# EAGLE design 2021 Deployment REVB (EAGLE 9.6.2)

## Sheet 1 of 2: Template
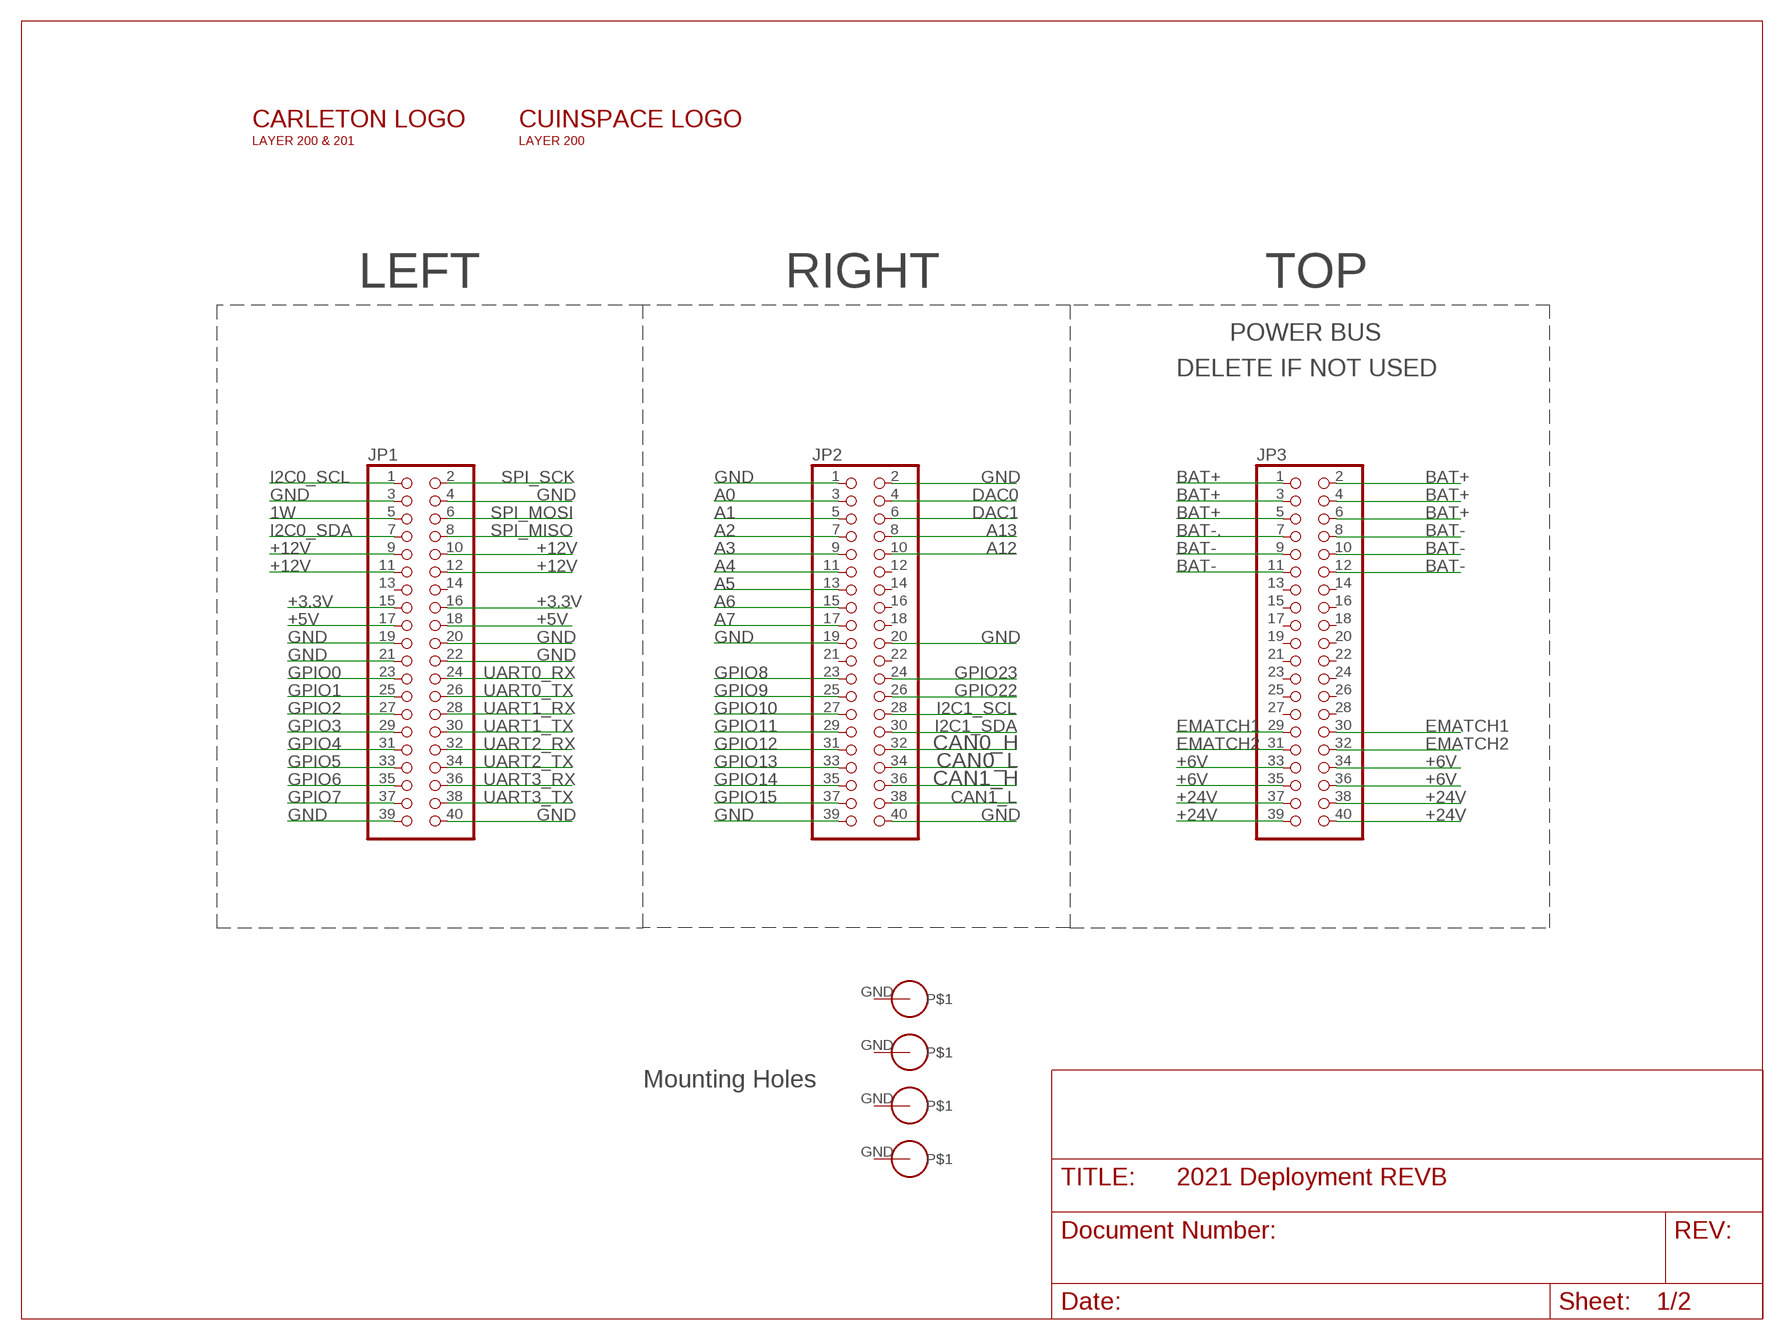
[diagram p0: schematic, sheet 1]

### Parts
$$U$1  PS/104-MOUNTING-HOLE  [PC/104-MOUNTING-HOLE]
JP1  PINHD-2X20  [2X20]
JP2  PINHD-2X20  [2X20]
JP3  PINHD-2X20  [2X20]
U$1  PS/104-MOUNTING-HOLE  [PC/104-MOUNTING-HOLE]
U$2  PS/104-MOUNTING-HOLE  [PC/104-MOUNTING-HOLE]
U$3  PS/104-MOUNTING-HOLE  [PC/104-MOUNTING-HOLE]
U$4  CARLETON3CM  [CARLETONU_3CM]
U$6  INSPACE3CM_L  [INSPACE_3CM_LETTERS]

### Nets
1W: JP1.5
+3.3V: JP1.15 JP1.16
+5V: JP1.17 JP1.18
+6V: JP3.33 JP3.34 JP3.35 JP3.36
+12V: JP1.9 JP1.10 JP1.11 JP1.12 ; also sheet 2
+24V: JP3.37 JP3.38 JP3.39 JP3.40
A0: JP2.3
A1: JP2.5
A2: JP2.7
A3: JP2.9
A4: JP2.11
A5: JP2.13
A6: JP2.15
A7: JP2.17
A12: JP2.10
A13: JP2.8
BAT+: JP3.1 JP3.2 JP3.3 JP3.4 JP3.5 JP3.6
BAT-: JP3.8 JP3.9 JP3.10 JP3.11 JP3.12
BAT-.: JP3.7
CAN0_H: JP2.32
CAN0_L: JP2.34
CAN1_H: JP2.36
CAN1_L: JP2.38
DAC0: JP2.4
DAC1: JP2.6
EMATCH1: JP3.29 JP3.30 ; also sheet 2
EMATCH2: JP3.31 JP3.32 ; also sheet 2
GND [New Class]: JP1.3 JP1.4 JP1.19 JP1.20 JP1.21 JP1.22 JP1.39 JP1.40 JP2.1 JP2.2 JP2.19 JP2.20 JP2.39 JP2.40 ; also sheet 2
GPIO0: JP1.23
GPIO1: JP1.25
GPIO2: JP1.27
GPIO3: JP1.29
GPIO4: JP1.31
GPIO5: JP1.33
GPIO6: JP1.35
GPIO7: JP1.37
GPIO8: JP2.23
GPIO9: JP2.25
GPIO10: JP2.27
GPIO11: JP2.29
GPIO12: JP2.31
GPIO13: JP2.33
GPIO14: JP2.35
GPIO15: JP2.37
GPIO22: JP2.26 ; also sheet 2
GPIO23: JP2.24 ; also sheet 2
I2C0_SCL: JP1.1
I2C0_SDA: JP1.7
I2C1_SCL: JP2.28
I2C1_SDA: JP2.30
SPI_MISO: JP1.8
SPI_MOSI: JP1.6
SPI_SCK: JP1.2
UART0_RX: JP1.24
UART0_TX: JP1.26
UART1_RX: JP1.28
UART1_TX: JP1.30
UART2_RX: JP1.32
UART2_TX: JP1.34
UART3_RX: JP1.36
UART3_TX: JP1.38
Unconnected: $$U$1.GND JP1.13 JP1.14 JP2.12 JP2.14 JP2.16 JP2.18 JP2.21 JP2.22 JP3.13 JP3.14 JP3.15 JP3.16 JP3.17 JP3.18 JP3.19 JP3.20 JP3.21 JP3.22 JP3.23 JP3.24 JP3.25 JP3.26 JP3.27 JP3.28 U$1.GND U$2.GND U$3.GND

### Notes on the sheet
- LEFT | RIGHT | TOP
- POWER BUS
- DELETE IF NOT USED
- Mounting Holes

## Sheet 2 of 2
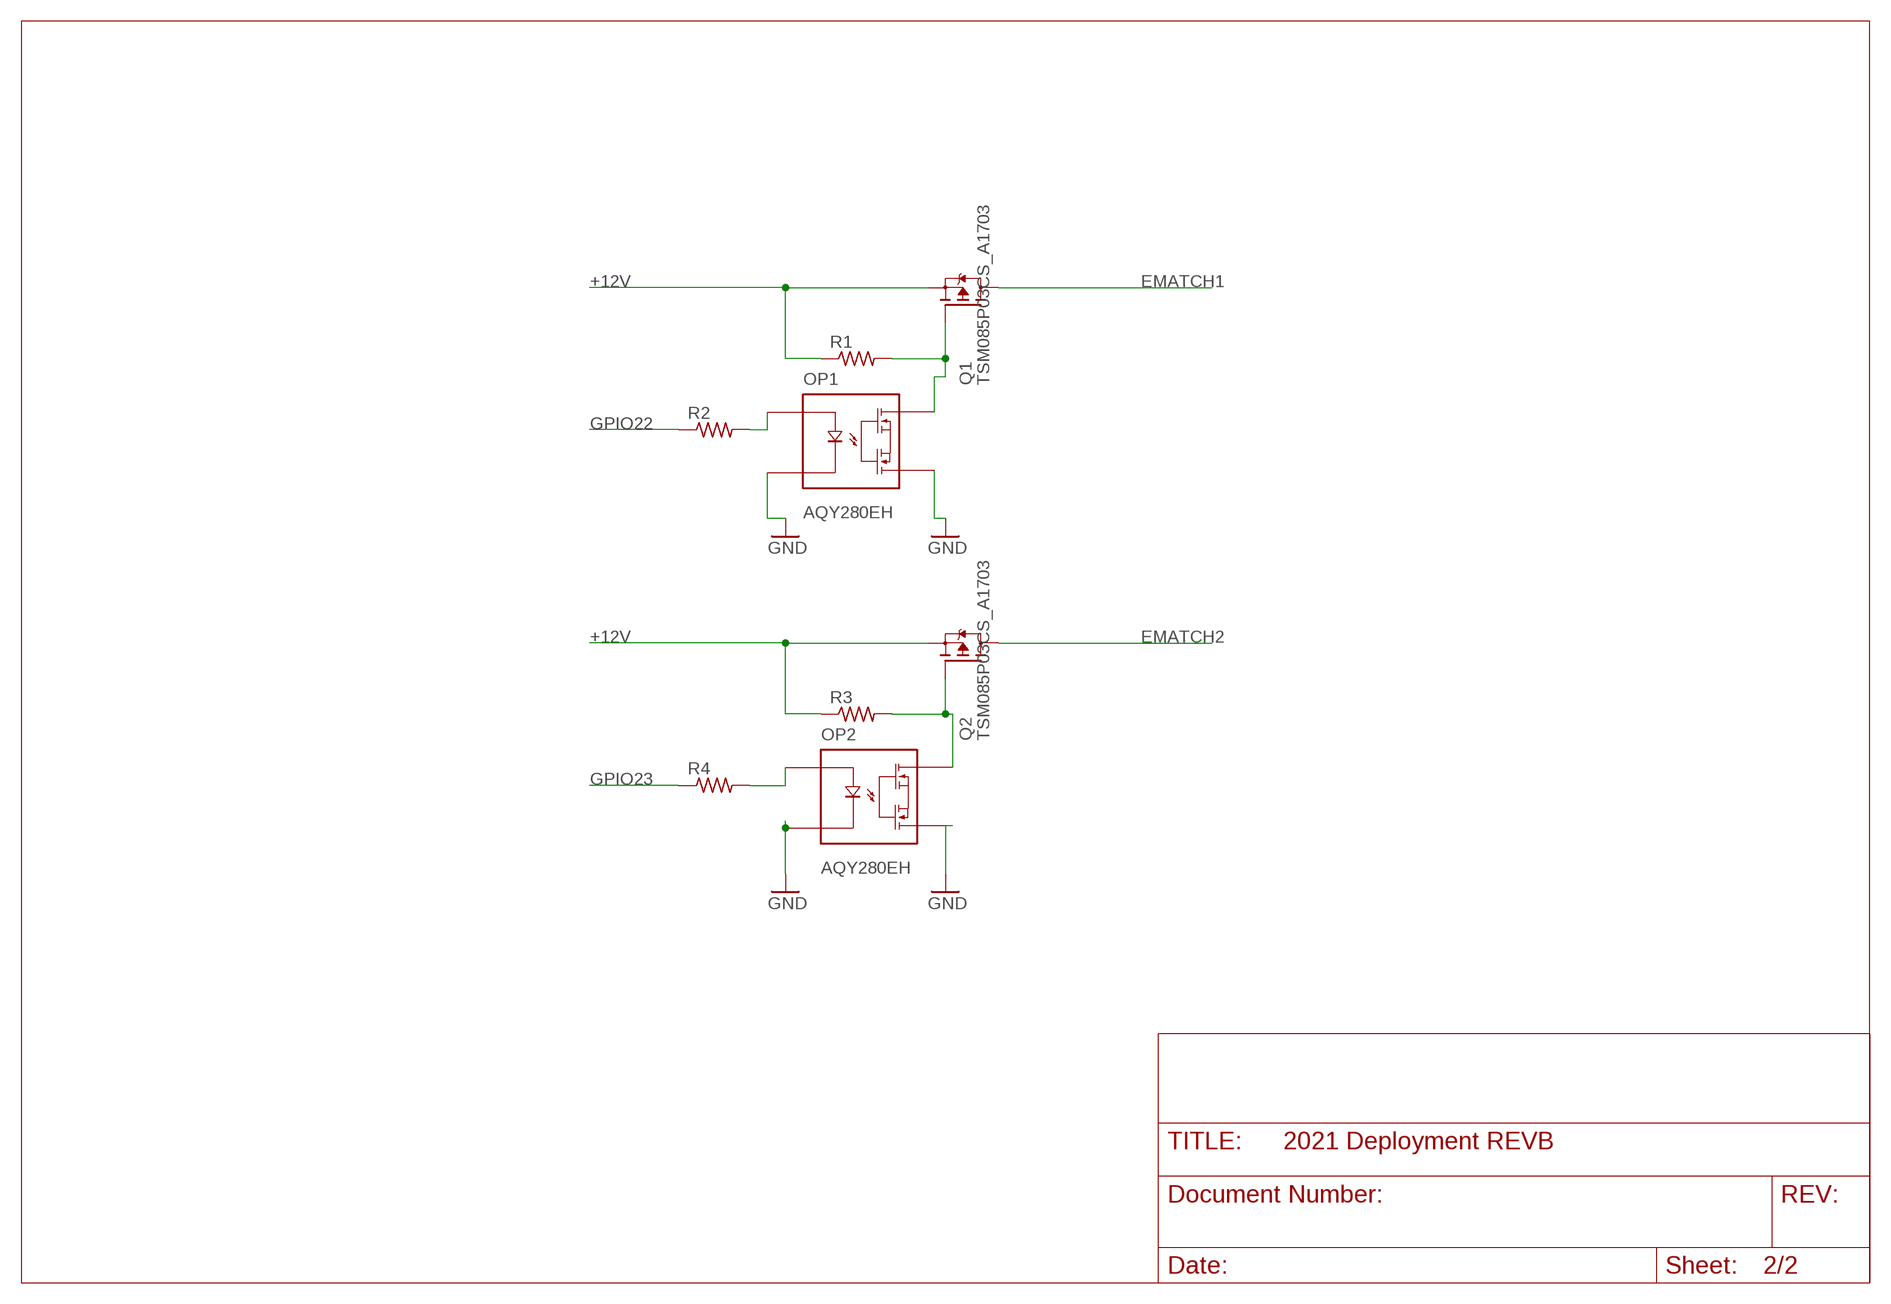
[diagram p1: schematic, sheet 2]

### Parts
OP1  AQY280EH  [AQY280EH]
OP2  AQY280EH  [AQY280EH]
Q1  TSM085P03CS_A1703  [TSM085P03CS_A1703]
Q2  TSM085P03CS_A1703  [TSM085P03CS_A1703]
R1  R-US_R0805  [R0805]
R2  R-US_R0805  [R0805]
R3  R-US_R0805  [R0805]
R4  R-US_R0805  [R0805]

### Nets
+12V: Q1.PIN1(S) Q1.PIN2(S) Q1.PIN3(S) Q2.PIN1(S) Q2.PIN2(S) Q2.PIN3(S) R1.1 R3.1 ; also sheet 1
EMATCH1: Q1.PIN5(D) Q1.PIN6(D) Q1.PIN7(D) Q1.PIN8(D) ; also sheet 1
EMATCH2: Q2.PIN5(D) Q2.PIN6(D) Q2.PIN7(D) Q2.PIN8(D) ; also sheet 1
GND [New Class]: OP1.PIN2(C) OP1.PIN3(BOTTOM) OP2.PIN2(C) OP2.PIN3(BOTTOM) ; also sheet 1
GPIO22: R2.1 ; also sheet 1
GPIO23: R4.1 ; also sheet 1
N$1: OP2.PIN1(A) R4.2
N$2: OP2.PIN4(TOP) Q2.PIN4(G) R3.2
N$3: OP1.PIN1(A) R2.2
N$5: OP1.PIN4(TOP) Q1.PIN4(G) R1.2

## Library data of the parts
$$U$1 U$1-U$3 = CU inSpace 2019 Parts:PS/104-MOUNTING-HOLE: Mounting hole for PC/104 board.
JP1-JP3 = pinhead:PINHD-2X20: PIN HEADER
OP1 OP2 = Deployment REVB:AQY280EH
Q1 Q2 = Deployment REVB:TSM085P03CS_A1703
R1-R4 = rcl:R-US_: RESISTOR, American symbol; SPICEPREFIX: R
U$4 = Logos:CARLETON
U$6 = Logos:INSPACE

## Net classes
2 diff pairs: width 0.254 mm

## Board
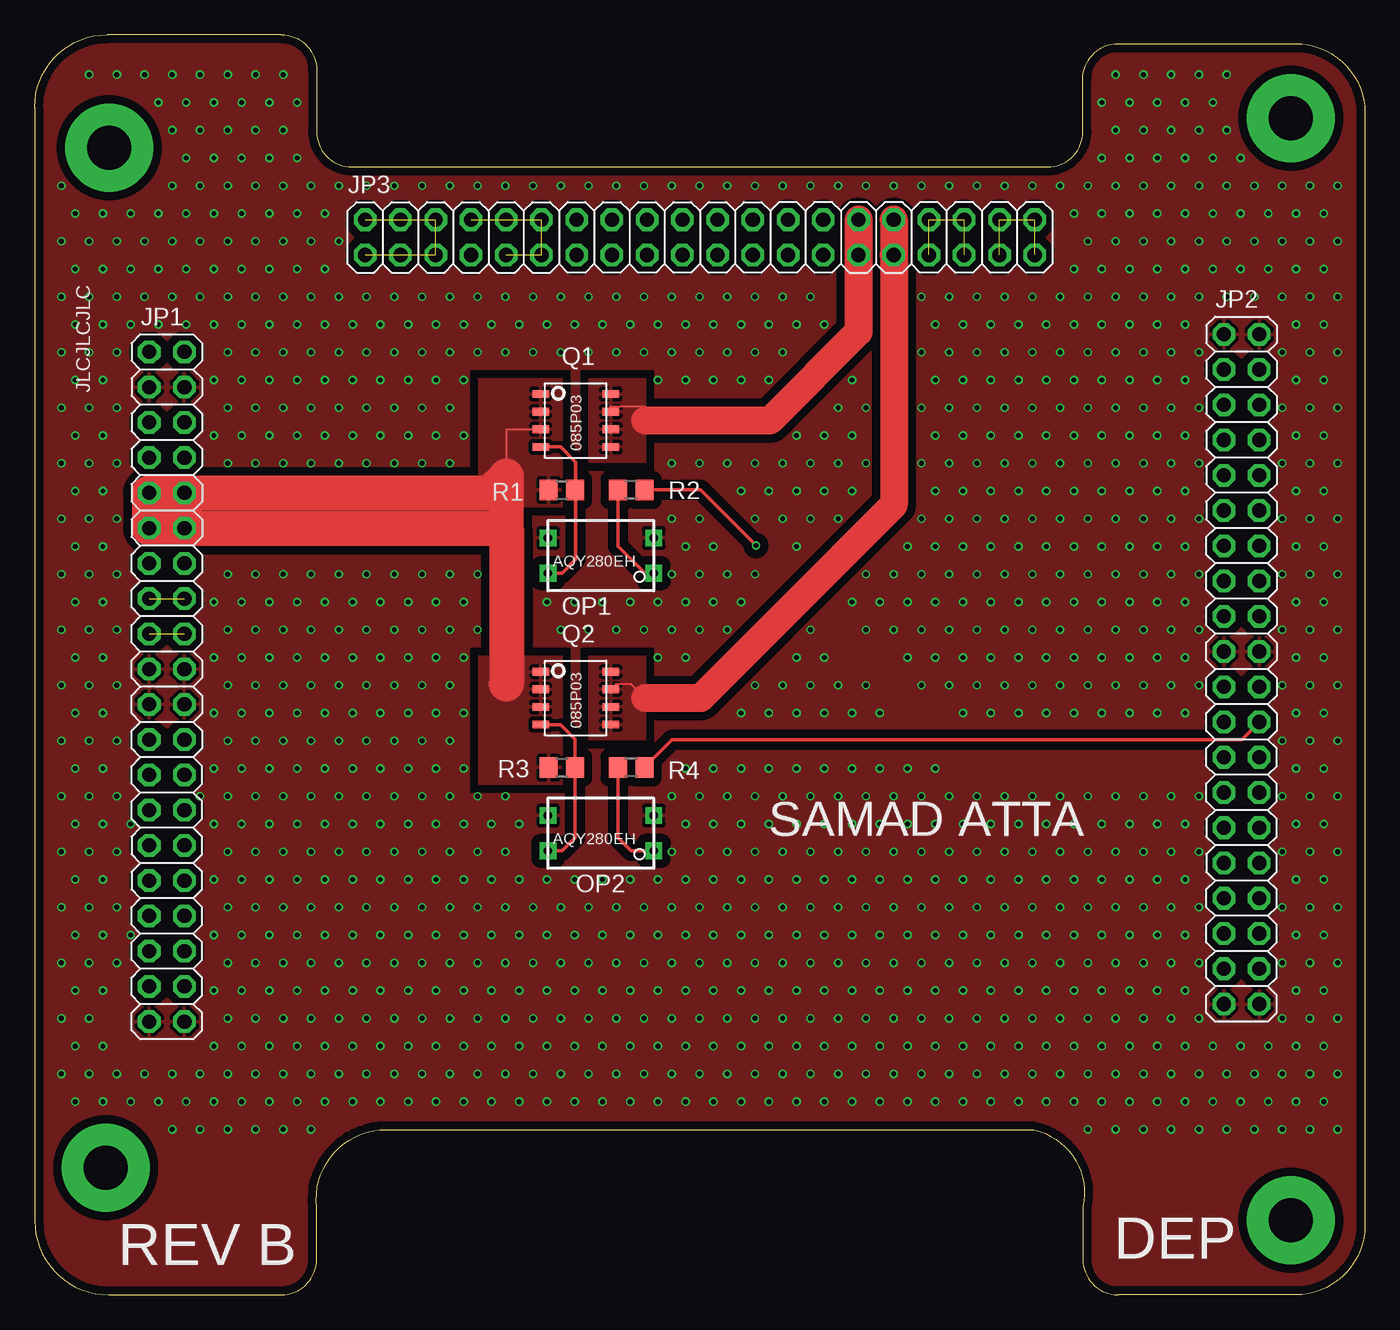
[diagram p2: board, top side]
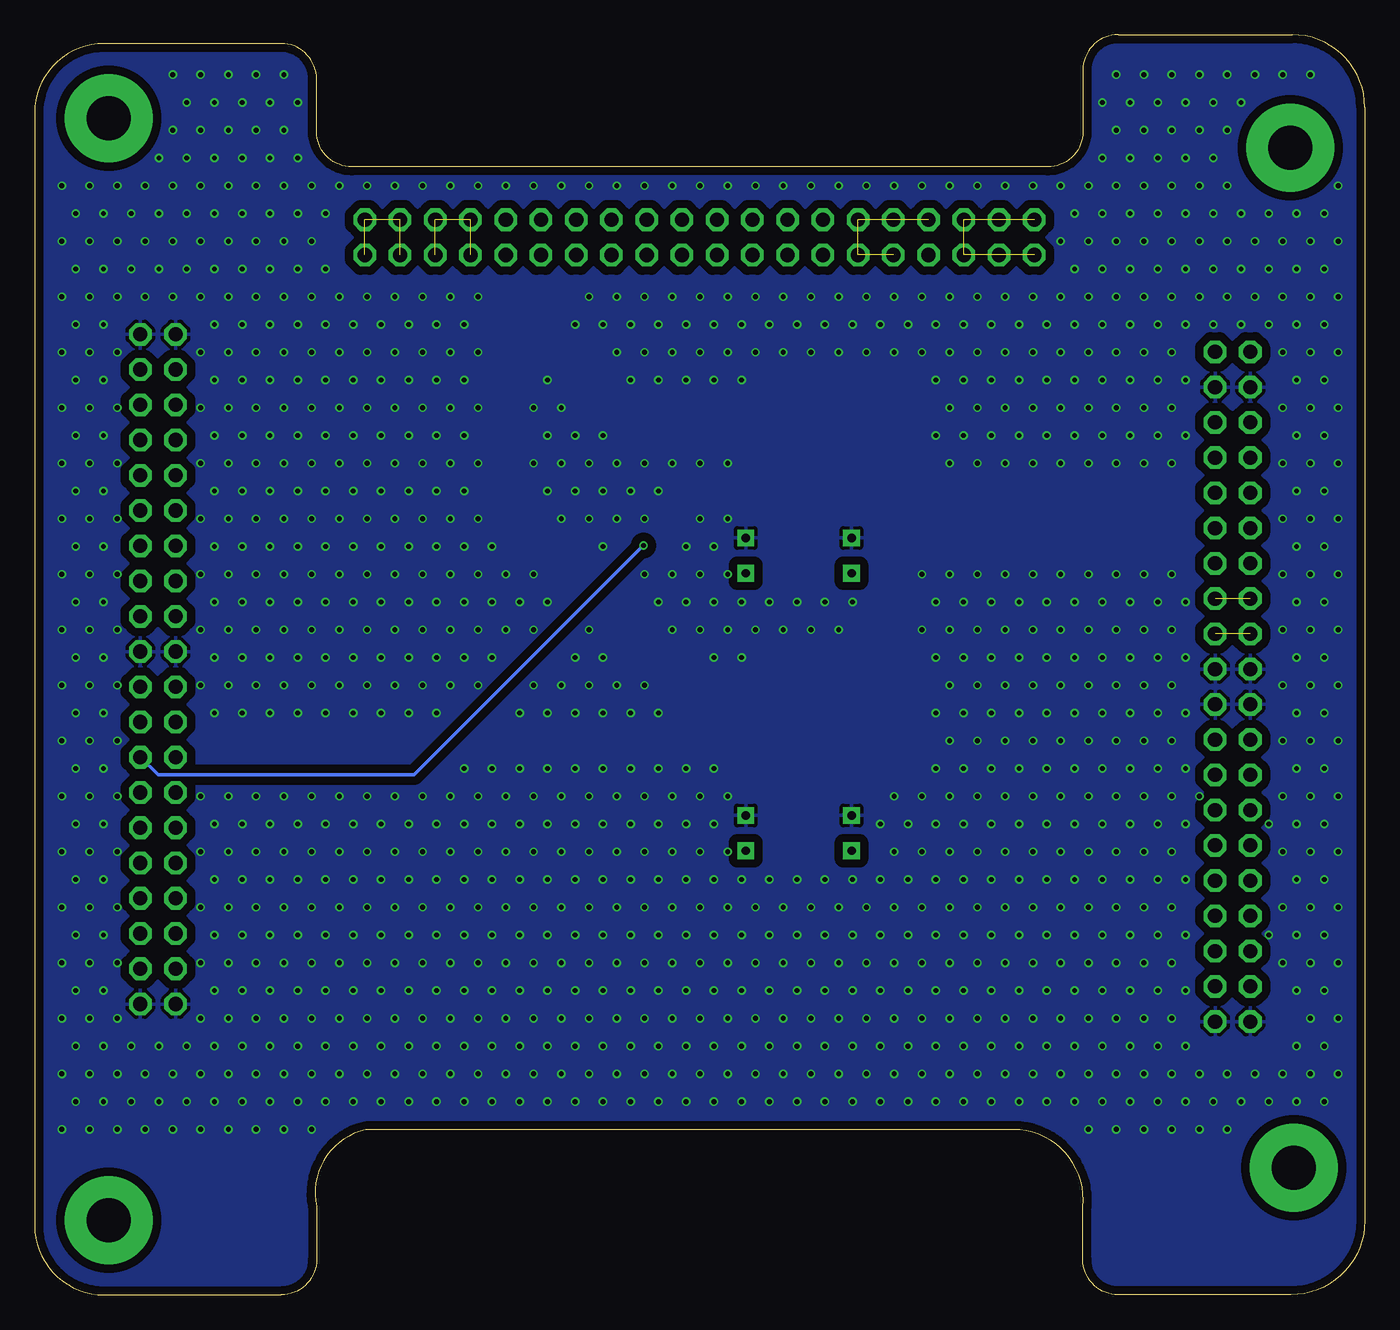
[diagram p3: board, bottom side, seen from below]

Size 95.89 x 90.81 mm. Coordinates in mm from the lower left corner, seen from the top.
Outline: 0,85.57 0,5.33 arc90 5.33,0 17.78,0 arc90 20.32,2.54 20.32,6.35 arc-90 24.86,11.89 72.03,11.89 arc-90 75.56,6.35 75.56,2.54 arc90 78.11,0 90.89,0 arc90 95.89,5 95.89,85.17 arc90 90.89,90.17 78.11,90.17 arc90 75.56,87.63 75.56,83.82 arc-90 73.03,81.28 22.86,81.28 arc-90 20.32,83.82 20.32,88.27 arc90 17.78,90.81 5.23,90.81 arc90 0,85.57
Copper layers (1*16): Top 0.035mm / dielectric 1.53mm / Bottom 0.035mm
Design rules "JLC 2 Layer *": minimum track width 5mil, minimum drill 0.2mm, track to track 3.5mil, track to pad 3.5mil, pad to pad 5mil, via to via 10mil, smd to smd 0mil, copper to edge 10mil, drill to drill 10mil, minimum pad ring 12mil, minimum via ring 5mil, stop-mask expansion 4mil, vias tented up to drill 0.4mm, thermal gap 10mil

### Footprints (pad centres in the part's own frame; a part is rotated, then mirrored left to right if it is on the bottom)
PC/104-MOUNTING-HOLE = drill 3.175 pad 6.35: GND 0,0
2X20 = drill 1.016 octagon: 1 -24.13,-1.27; 2 -24.13,1.27; 3 -21.59,-1.27; 4 -21.59,1.27; 5 -19.05,-1.27; 6 -19.05,1.27; 7 -16.51,-1.27; 8 -16.51,1.27; 9 -13.97,-1.27; 10 -13.97,1.27; 11 -11.43,-1.27; 12 -11.43,1.27; 13 -8.89,-1.27; 14 -8.89,1.27; 15 -6.35,-1.27; 16 -6.35,1.27; 17 -3.81,-1.27; 18 -3.81,1.27; 19 -1.27,-1.27; 20 -1.27,1.27; 21 1.27,-1.27; 22 1.27,1.27; 23 3.81,-1.27; 24 3.81,1.27; 25 6.35,-1.27; 26 6.35,1.27; 27 8.89,-1.27; 28 8.89,1.27; 29 11.43,-1.27; 30 11.43,1.27; 31 13.97,-1.27; 32 13.97,1.27; 33 16.51,-1.27; 34 16.51,1.27; 35 19.05,-1.27; 36 19.05,1.27; 37 21.59,-1.27; 38 21.59,1.27; 39 24.13,-1.27; 40 24.13,1.27
AQY280EH = drill 0.6 pad 0.813 square: PIN1 0,-7.62; PIN2 2.54,-7.62; PIN3 2.54,0; PIN4 0,0
TSM085P03CS_A1703 = smd 0.559 x 1.194: PIN1 -1.905,-2.527; PIN2 -0.635,-2.527; PIN3 0.635,-2.527; PIN4 1.905,-2.527; PIN5 1.905,2.527; PIN6 0.635,2.527; PIN7 -0.635,2.527; PIN8 -1.905,2.527
R0805 = smd 1.3 x 1.5: 1 -0.95,0; 2 0.95,0

### Placement (x,y rotation side)
$$U$1  5.13,9.17 0 top
JP1  9.53,43.81 270 top
JP2  87,45.09 270 top
JP3  47.96,76.2 0 top
OP1  37,52 90 top
OP2  37,32 90 top
Q1  39,63 270 top
Q2  39,43 270 top
R1  38,58 0 top
R2  43,58 180 top
R3  38,38 0 top
R4  43,38 180 top
U$1  90.55,84.79 0 top
U$2  5.36,82.65 0 top
U$3  90.55,5.36 0 top
U$4  17.3,18.5 0 top
U$6  50.91,21.53 0 top

### Tracks (layer width: path | path; a pad name or v marks a point on that pad's centre or on a via)
+3.3V  (1 unrouted)
+5V  (1 unrouted)
+6V  (3 unrouted)
+12V
  Top 0.127: Q1.PIN3 34,62.37 34,59
  Top 2.54: JP1.9 JP1.12 | JP1.11 JP1.10 | JP1.10 JP1.12 | JP1.9 JP1.11 | JP1.9 JP1.10 | JP1.11 JP1.12 | JP1.10 32.78,57.78 34,59 34,55.24 | JP1.12 34,55.24 | 34,55.24 34,44
  pour Top (isolate 0.305): 32,66 32,56.8 38,56.8 38,66
  pour Top (isolate 0.305): 32,46 32,36.8 38,36.8 38,46
+24V  (3 unrouted)
BAT+  (5 unrouted)
BAT-  (4 unrouted)
EMATCH1
  Top 0.127: 44,63 44,64 41.53,64 Q1.PIN7
  Top 2: JP3.30 JP3.29 59.38,69.39 53,63 44,63
  pour Top: 40,60 40,66 44,66 44,60
EMATCH2
  Top 0.127: 44,43 43,44 41.89,44 Q2.PIN7
  Top 2: JP3.32 JP3.31 61.92,56.92 48,43 44,43
  pour Top: 40,40 40,46 44,46 44,40
GND  (via drill 0.35)
  other vias: 2.92,13.92 1.92,15.92 2.92,17.92 1.92,19.92 2.92,21.92 1.92,23.92 2.92,25.92 1.92,27.92 2.92,29.92 1.92,31.92 2.92,33.92 1.92,35.92 2.92,37.92 1.92,39.92 2.92,41.92 1.92,43.92 2.92,45.92 1.92,47.92 2.92,49.92 1.92,51.92 2.92,53.92 1.92,55.92 2.92,57.92 1.92,59.92 2.92,61.92 1.92,63.92 2.92,65.92 1.92,67.92 2.92,69.92 1.92,71.92 2.92,73.92 1.92,75.92 2.92,77.92 1.92,79.92 4.92,13.92 3.92,15.92 4.92,17.92 3.92,19.92 4.92,21.92 3.92,23.92 4.92,25.92 3.92,27.92 4.92,29.92 3.92,31.92 4.92,33.92 3.92,35.92 4.92,37.92 3.92,39.92 4.92,41.92 3.92,43.92 4.92,45.92 3.92,47.92 4.92,49.92 3.92,51.92 4.92,53.92 3.92,55.92 4.92,57.92 3.92,59.92 4.92,61.92 3.92,63.92 4.92,65.92 3.92,67.92 4.92,69.92 3.92,71.92 4.92,73.92 3.92,75.92 4.92,77.92 3.92,87.92 6.92,13.92 5.92,15.92 5.92,23.92 6.92,25.92 5.92,27.92 5.92,31.92 6.92,33.92 5.92,35.92 5.92,39.92 5.92,43.92 5.92,47.92 5.92,51.92 5.92,55.92 5.92,59.92 5.92,63.92 5.92,67.92 6.92,69.92 5.92,71.92 6.92,73.92 5.92,75.92 6.92,77.92 5.92,87.92 8.92,13.92 7.92,15.92 8.92,69.92 7.92,71.92 8.92,73.92 7.92,75.92 8.92,77.92 8.92,85.92 7.92,87.92 9.92,11.92 10.92,13.92 9.92,15.92 10.92,69.92 9.92,71.92 10.92,73.92 9.92,75.92 10.92,77.92 9.92,79.92 10.92,81.92 9.92,83.92 10.92,85.92 9.92,87.92 11.92,11.92 12.92,13.92 11.92,15.92 12.92,17.92 12.92,21.92 12.92,25.92 12.92,29.92 12.92,33.92 11.92,35.92 12.92,37.92 12.92,41.92 12.92,45.92 12.92,49.92 12.92,61.92 12.92,65.92 12.92,69.92 11.92,71.92 12.92,73.92 11.92,75.92 12.92,77.92 11.92,79.92 12.92,81.92 11.92,83.92 12.92,85.92 11.92,87.92 13.92,11.92 14.92,13.92 13.92,15.92 14.92,17.92 13.92,19.92 14.92,21.92 13.92,23.92 14.92,25.92 13.92,27.92 14.92,29.92 13.92,31.92 14.92,33.92 13.92,35.92 14.92,37.92 13.92,39.92 14.92,41.92 13.92,43.92 14.92,45.92 13.92,47.92 14.92,49.92 13.92,51.92 13.92,59.92 14.92,61.92 13.92,63.92 14.92,65.92 13.92,67.92 14.92,69.92 13.92,71.92 14.92,73.92 13.92,75.92 14.92,77.92 13.92,79.92 14.92,81.92 13.92,83.92 14.92,85.92 13.92,87.92 15.92,11.92 16.92,13.92 15.92,15.92 16.92,17.92 15.92,19.92 16.92,21.92 15.92,23.92 16.92,25.92 15.92,27.92 16.92,29.92 15.92,31.92 16.92,33.92 15.92,35.92 16.92,37.92 15.92,39.92 16.92,41.92 15.92,43.92 16.92,45.92 15.92,47.92 16.92,49.92 15.92,51.92 15.92,59.92 16.92,61.92 15.92,63.92 16.92,65.92 15.92,67.92 16.92,69.92 15.92,71.92 16.92,73.92 15.92,75.92 16.92,77.92 15.92,79.92 16.92,81.92 15.92,83.92 16.92,85.92 15.92,87.92 17.92,11.92 18.92,13.92 17.92,15.92 18.92,17.92 17.92,19.92 18.92,21.92 17.92,23.92 18.92,25.92 17.92,27.92 18.92,29.92 17.92,31.92 18.92,33.92 17.92,35.92 18.92,37.92 17.92,39.92 18.92,41.92 17.92,43.92 18.92,45.92 17.92,47.92 18.92,49.92 17.92,51.92 17.92,59.92 18.92,61.92 17.92,63.92 18.92,65.92 17.92,67.92 18.92,69.92 17.92,71.92 18.92,73.92 17.92,75.92 18.92,77.92 17.92,79.92 18.92,81.92 17.92,83.92 18.92,85.92 17.92,87.92 19.92,11.92 20.92,13.92 19.92,15.92 20.92,17.92 19.92,19.92 20.92,21.92 19.92,23.92 20.92,25.92 19.92,27.92 20.92,29.92 19.92,31.92 20.92,33.92 19.92,35.92 20.92,37.92 19.92,39.92 20.92,41.92 19.92,43.92 20.92,45.92 19.92,47.92 20.92,49.92 19.92,51.92 19.92,59.92 20.92,61.92 19.92,63.92 20.92,65.92 19.92,67.92 20.92,69.92 19.92,71.92 20.92,73.92 19.92,75.92 20.92,77.92 19.92,79.92 22.92,13.92 21.92,15.92 22.92,17.92 21.92,19.92 22.92,21.92 21.92,23.92 22.92,25.92 21.92,27.92 22.92,29.92 21.92,31.92 22.92,33.92 21.92,35.92 22.92,37.92 21.92,39.92 22.92,41.92 21.92,43.92 22.92,45.92 21.92,47.92 22.92,49.92 21.92,51.92 21.92,59.92 22.92,61.92 21.92,63.92 22.92,65.92 21.92,67.92 22.92,69.92 21.92,71.92 21.92,75.92 21.92,79.92 24.92,13.92 23.92,15.92 24.92,17.92 23.92,19.92 24.92,21.92 23.92,23.92 24.92,25.92 23.92,27.92 24.92,29.92 23.92,31.92 24.92,33.92 23.92,35.92 24.92,37.92 23.92,39.92 24.92,41.92 23.92,43.92 24.92,45.92 23.92,47.92 24.92,49.92 23.92,51.92 23.92,59.92 24.92,61.92 23.92,63.92 24.92,65.92 23.92,67.92 24.92,69.92 23.92,71.92 23.92,79.92 26.92,13.92 25.92,15.92 26.92,17.92 25.92,19.92 26.92,21.92 25.92,23.92 26.92,25.92 25.92,27.92 26.92,29.92 25.92,31.92 26.92,33.92 25.92,35.92 26.92,37.92 25.92,39.92 26.92,41.92 25.92,43.92 26.92,45.92 25.92,47.92 26.92,49.92 25.92,51.92 25.92,59.92 26.92,61.92 25.92,63.92 26.92,65.92 25.92,67.92 26.92,69.92 25.92,71.92 25.92,79.92 28.92,13.92 27.92,15.92 28.92,17.92 27.92,19.92 28.92,21.92 27.92,23.92 28.92,25.92 27.92,27.92 28.92,29.92 27.92,31.92 28.92,33.92 27.92,35.92 28.92,37.92 27.92,39.92 28.92,41.92 27.92,43.92 28.92,45.92 27.92,47.92 28.92,49.92 27.92,51.92 27.92,59.92 28.92,61.92 27.92,63.92 28.92,65.92 27.92,67.92 28.92,69.92 27.92,71.92 27.92,79.92 30.92,13.92 29.92,15.92 30.92,17.92 29.92,19.92 30.92,21.92 29.92,23.92 30.92,25.92 29.92,27.92 30.92,29.92 29.92,31.92 30.92,33.92 29.92,35.92 30.92,37.92 29.92,39.92 30.92,41.92 29.92,43.92 30.92,45.92 29.92,47.92 30.92,49.92 29.92,51.92 29.92,59.92 30.92,61.92 29.92,63.92 30.92,65.92 29.92,67.92 30.92,69.92 29.92,71.92 29.92,79.92 32.92,13.92 31.92,15.92 32.92,17.92 31.92,19.92 32.92,21.92 31.92,23.92 32.92,25.92 31.92,27.92 32.92,29.92 31.92,31.92 32.92,33.92 31.92,35.92 31.92,47.92 31.92,51.92 31.92,67.92 32.92,69.92 31.92,71.92 31.92,79.92 34.92,13.92 33.92,15.92 34.92,17.92 33.92,19.92 34.92,21.92 33.92,23.92 34.92,25.92 33.92,27.92 34.92,29.92 33.92,31.92 34.92,33.92 33.92,35.92 33.92,67.92 34.92,69.92 33.92,71.92 33.92,79.92 36.92,13.92 35.92,15.92 36.92,17.92 35.92,19.92 36.92,21.92 35.92,23.92 36.92,25.92 35.92,27.92 36.92,29.92 36.92,49.92 35.92,67.92 36.92,69.92 35.92,71.92 35.92,79.92 38.92,13.92 37.92,15.92 38.92,17.92 37.92,19.92 38.92,21.92 37.92,23.92 38.92,25.92 37.92,27.92 38.92,29.92 37.92,47.92 38.92,49.92 37.92,67.92 38.92,69.92 37.92,71.92 37.92,79.92 40.92,13.92 39.92,15.92 40.92,17.92 39.92,19.92 40.92,21.92 39.92,23.92 40.92,25.92 39.92,27.92 40.92,29.92 39.92,47.92 40.92,49.92 39.92,67.92 40.92,69.92 39.92,71.92 39.92,79.92 42.92,13.92 41.92,15.92 42.92,17.92 41.92,19.92 42.92,21.92 41.92,23.92 42.92,25.92 41.92,27.92 42.92,29.92 41.92,47.92 42.92,49.92 41.92,67.92 42.92,69.92 41.92,71.92 41.92,79.92 44.92,13.92 43.92,15.92 44.92,17.92 43.92,19.92 44.92,21.92 43.92,23.92 44.92,25.92 43.92,27.92 44.92,29.92 44.92,45.92 43.92,47.92 44.92,49.92 44.92,65.92 43.92,67.92 44.92,69.92 43.92,71.92 43.92,79.92 46.92,13.92 45.92,15.92 46.92,17.92 45.92,19.92 46.92,21.92 45.92,23.92 46.92,25.92 45.92,27.92 46.92,29.92 45.92,31.92 46.92,33.92 45.92,35.92 46.92,37.92 46.92,45.92 45.92,47.92 46.92,49.92 45.92,51.92 46.92,53.92 45.92,55.92 45.92,59.92 46.92,65.92 45.92,67.92 46.92,69.92 45.92,71.92 45.92,79.92 48.92,13.92 47.92,15.92 48.92,17.92 47.92,19.92 48.92,21.92 47.92,23.92 48.92,25.92 47.92,27.92 48.92,29.92 47.92,31.92 48.92,33.92 47.92,35.92 48.92,37.92 47.92,47.92 48.92,49.92 47.92,51.92 48.92,53.92 47.92,55.92 47.92,59.92 48.92,65.92 47.92,67.92 48.92,69.92 47.92,71.92 47.92,79.92 50.92,13.92 49.92,15.92 50.92,17.92 49.92,19.92 50.92,21.92 49.92,23.92 50.92,25.92 49.92,27.92 50.92,29.92 49.92,31.92 50.92,33.92 49.92,35.92 50.92,37.92 50.92,41.92 49.92,47.92 50.92,49.92 49.92,51.92 50.92,57.92 49.92,59.92 50.92,65.92 49.92,67.92 50.92,69.92 49.92,71.92 49.92,79.92 52.92,13.92 51.92,15.92 52.92,17.92 51.92,19.92 52.92,21.92 51.92,23.92 52.92,25.92 51.92,27.92 52.92,29.92 51.92,31.92 52.92,33.92 51.92,35.92 52.92,37.92 52.92,41.92 51.92,43.92 51.92,51.92 51.92,55.92 52.92,57.92 51.92,59.92 52.92,65.92 51.92,67.92 52.92,69.92 51.92,71.92 51.92,79.92 54.92,13.92 53.92,15.92 54.92,17.92 53.92,19.92 54.92,21.92 53.92,23.92 54.92,25.92 53.92,27.92 54.92,29.92 53.92,31.92 54.92,33.92 53.92,35.92 54.92,37.92 54.92,41.92 53.92,43.92 54.92,45.92 54.92,53.92 53.92,55.92 54.92,57.92 53.92,59.92 54.92,61.92 53.92,67.92 54.92,69.92 53.92,71.92 53.92,79.92 56.92,13.92 55.92,15.92 56.92,17.92 55.92,19.92 56.92,21.92 55.92,23.92 56.92,25.92 55.92,27.92 56.92,29.92 55.92,31.92 56.92,33.92 55.92,35.92 56.92,37.92 56.92,41.92 55.92,43.92 56.92,45.92 55.92,47.92 55.92,55.92 56.92,57.92 55.92,59.92 56.92,61.92 56.92,69.92 55.92,71.92 55.92,79.92 58.92,13.92 57.92,15.92 58.92,17.92 57.92,19.92 58.92,21.92 57.92,23.92 58.92,25.92 57.92,27.92 58.92,29.92 57.92,31.92 58.92,33.92 57.92,35.92 58.92,37.92 58.92,41.92 57.92,43.92 58.92,49.92 57.92,55.92 58.92,57.92 57.92,59.92 58.92,61.92 57.92,63.92 58.92,65.92 57.92,79.92 60.92,13.92 59.92,15.92 60.92,17.92 59.92,19.92 60.92,21.92 59.92,23.92 60.92,25.92 59.92,27.92 60.92,29.92 59.92,31.92 60.92,33.92 59.92,35.92 60.92,37.92 60.92,41.92 59.92,43.92 59.92,47.92 60.92,49.92 59.92,51.92 59.92,59.92 59.92,63.92 59.92,79.92 62.92,13.92 61.92,15.92 62.92,17.92 61.92,19.92 62.92,21.92 61.92,23.92 62.92,25.92 61.92,27.92 62.92,29.92 61.92,31.92 62.92,33.92 61.92,35.92 62.92,37.92 62.92,45.92 61.92,47.92 62.92,49.92 61.92,51.92 62.92,53.92 61.92,79.92 64.92,13.92 63.92,15.92 64.92,17.92 63.92,19.92 64.92,21.92 63.92,23.92 64.92,25.92 63.92,27.92 64.92,29.92 63.92,31.92 64.92,33.92 63.92,35.92 64.92,37.92 63.92,43.92 64.92,45.92 63.92,47.92 64.92,49.92 63.92,51.92 64.92,53.92 63.92,55.92 64.92,57.92 63.92,59.92 64.92,61.92 63.92,63.92 64.92,65.92 63.92,67.92 64.92,69.92 63.92,71.92 63.92,79.92 66.92,13.92 65.92,15.92 66.92,17.92 65.92,19.92 66.92,21.92 65.92,23.92 66.92,25.92 65.92,27.92 66.92,29.92 65.92,31.92 66.92,33.92 65.92,35.92 66.92,41.92 65.92,43.92 66.92,45.92 65.92,47.92 66.92,49.92 65.92,51.92 66.92,53.92 65.92,55.92 66.92,57.92 65.92,59.92 66.92,61.92 65.92,63.92 66.92,65.92 65.92,67.92 66.92,69.92 65.92,71.92 65.92,79.92 68.92,13.92 67.92,15.92 68.92,17.92 67.92,19.92 68.92,21.92 67.92,23.92 68.92,25.92 67.92,27.92 68.92,29.92 67.92,31.92 68.92,33.92 67.92,35.92 68.92,41.92 67.92,43.92 68.92,45.92 67.92,47.92 68.92,49.92 67.92,51.92 68.92,53.92 67.92,55.92 68.92,57.92 67.92,59.92 68.92,61.92 67.92,63.92 68.92,65.92 67.92,67.92 68.92,69.92 67.92,71.92 67.92,79.92 70.92,13.92 69.92,15.92 70.92,17.92 69.92,19.92 70.92,21.92 69.92,23.92 70.92,25.92 69.92,27.92 70.92,29.92 69.92,31.92 70.92,33.92 69.92,35.92 70.92,41.92 69.92,43.92 70.92,45.92 69.92,47.92 70.92,49.92 69.92,51.92 70.92,53.92 69.92,55.92 70.92,57.92 69.92,59.92 70.92,61.92 69.92,63.92 70.92,65.92 69.92,67.92 70.92,69.92 69.92,71.92 69.92,79.92 72.92,13.92 71.92,15.92 72.92,17.92 71.92,19.92 72.92,21.92 71.92,23.92 72.92,25.92 71.92,27.92 72.92,29.92 71.92,31.92 72.92,33.92 71.92,35.92 72.92,41.92 71.92,43.92 72.92,45.92 71.92,47.92 72.92,49.92 71.92,51.92 72.92,53.92 71.92,55.92 72.92,57.92 71.92,59.92 72.92,61.92 71.92,63.92 72.92,65.92 71.92,67.92 72.92,69.92 71.92,71.92 71.92,79.92 74.92,13.92 73.92,15.92 74.92,17.92 73.92,19.92 74.92,21.92 73.92,23.92 74.92,25.92 73.92,27.92 74.92,29.92 73.92,31.92 74.92,33.92 73.92,35.92 74.92,41.92 73.92,43.92 74.92,45.92 73.92,47.92 74.92,49.92 73.92,51.92 74.92,53.92 73.92,55.92 74.92,57.92 73.92,59.92 74.92,61.92 73.92,63.92 74.92,65.92 73.92,67.92 74.92,69.92 73.92,71.92 74.92,73.92 74.92,77.92 73.92,79.92 75.92,11.92 76.92,13.92 75.92,15.92 76.92,17.92 75.92,19.92 76.92,21.92 75.92,23.92 76.92,25.92 75.92,27.92 76.92,29.92 75.92,31.92 76.92,33.92 75.92,35.92 76.92,41.92 75.92,43.92 76.92,45.92 75.92,47.92 76.92,49.92 75.92,51.92 76.92,53.92 75.92,55.92 76.92,57.92 75.92,59.92 76.92,61.92 75.92,63.92 76.92,65.92 75.92,67.92 76.92,69.92 75.92,71.92 76.92,73.92 75.92,75.92 76.92,77.92 75.92,79.92 76.92,81.92 76.92,85.92 77.92,11.92 78.92,13.92 77.92,15.92 78.92,17.92 77.92,19.92 78.92,21.92 77.92,23.92 78.92,25.92 77.92,27.92 78.92,29.92 77.92,31.92 78.92,33.92 77.92,35.92 78.92,41.92 77.92,43.92 78.92,45.92 77.92,47.92 78.92,49.92 77.92,51.92 78.92,53.92 77.92,55.92 78.92,57.92 77.92,59.92 78.92,61.92 77.92,63.92 78.92,65.92 77.92,67.92 78.92,69.92 77.92,71.92 78.92,73.92 77.92,75.92 78.92,77.92 77.92,79.92 78.92,81.92 77.92,83.92 78.92,85.92 77.92,87.92 79.92,11.92 80.92,13.92 79.92,15.92 80.92,17.92 79.92,19.92 80.92,21.92 79.92,23.92 80.92,25.92 79.92,27.92 80.92,29.92 79.92,31.92 80.92,33.92 79.92,35.92 80.92,41.92 79.92,43.92 80.92,45.92 79.92,47.92 80.92,49.92 79.92,51.92 80.92,53.92 79.92,55.92 80.92,57.92 79.92,59.92 80.92,61.92 79.92,63.92 80.92,65.92 79.92,67.92 80.92,69.92 79.92,71.92 80.92,73.92 79.92,75.92 80.92,77.92 79.92,79.92 80.92,81.92 79.92,83.92 80.92,85.92 79.92,87.92 81.92,11.92 82.92,13.92 81.92,15.92 82.92,17.92 81.92,19.92 82.92,21.92 81.92,23.92 82.92,25.92 81.92,27.92 82.92,29.92 81.92,31.92 82.92,33.92 81.92,35.92 82.92,41.92 81.92,43.92 82.92,45.92 81.92,47.92 82.92,49.92 81.92,51.92 82.92,53.92 81.92,55.92 82.92,57.92 81.92,59.92 82.92,61.92 81.92,63.92 82.92,65.92 81.92,67.92 82.92,69.92 81.92,71.92 82.92,73.92 81.92,75.92 82.92,77.92 81.92,79.92 82.92,81.92 81.92,83.92 82.92,85.92 81.92,87.92 83.92,11.92 84.92,13.92 83.92,15.92 84.92,17.92 83.92,19.92 83.92,23.92 83.92,27.92 83.92,31.92 83.92,35.92 83.92,43.92 83.92,47.92 83.92,51.92 83.92,55.92 83.92,59.92 83.92,63.92 83.92,67.92 83.92,71.92 84.92,73.92 83.92,75.92 84.92,77.92 83.92,79.92 84.92,81.92 83.92,83.92 84.92,85.92 83.92,87.92 85.92,11.92 86.92,13.92 85.92,15.92 86.92,17.92 85.92,71.92 86.92,73.92 85.92,75.92 86.92,77.92 85.92,79.92 86.92,81.92 85.92,83.92 85.92,87.92 87.92,11.92 88.92,13.92 87.92,15.92 88.92,17.92 87.92,71.92 88.92,73.92 87.92,75.92 88.92,77.92 87.92,79.92 89.92,11.92 90.92,13.92 89.92,15.92 90.92,17.92 89.92,19.92 90.92,21.92 89.92,23.92 90.92,25.92 89.92,27.92 90.92,29.92 89.92,31.92 90.92,33.92 89.92,35.92 90.92,37.92 89.92,39.92 90.92,41.92 89.92,43.92 90.92,45.92 89.92,47.92 90.92,49.92 89.92,51.92 90.92,53.92 89.92,55.92 90.92,57.92 89.92,59.92 90.92,61.92 89.92,63.92 90.92,65.92 89.92,67.92 90.92,69.92 89.92,71.92 90.92,73.92 89.92,75.92 90.92,77.92 89.92,79.92 91.92,11.92 92.92,13.92 91.92,15.92 92.92,17.92 91.92,19.92 92.92,21.92 91.92,23.92 92.92,25.92 91.92,27.92 92.92,29.92 91.92,31.92 92.92,33.92 91.92,35.92 92.92,37.92 91.92,39.92 92.92,41.92 91.92,43.92 92.92,45.92 91.92,47.92 92.92,49.92 91.92,51.92 92.92,53.92 91.92,55.92 92.92,57.92 91.92,59.92 92.92,61.92 91.92,63.92 92.92,65.92 91.92,67.92 92.92,69.92 91.92,71.92 92.92,73.92 91.92,75.92 92.92,77.92 91.92,79.92 93.92,11.92 93.92,15.92 93.92,19.92 93.92,23.92 93.92,27.92 93.92,31.92 93.92,35.92 93.92,39.92 93.92,43.92 93.92,47.92 93.92,51.92 93.92,55.92 93.92,59.92 93.92,63.92 93.92,67.92 93.92,71.92 93.92,75.92 93.92,79.92
  pour Top (isolate 0.61, rank 6): 0,0 0,90.81 93.98,90.81 95.89,90.81 95.89,0
  pour Bottom (isolate 0.61): 0,0 0,90.81 93.98,90.81 95.89,90.81 95.89,0
GPIO22  (via drill 0.35)
  Top 0.254: R2.1 48,58 v52,54
  Bottom 0.254: v52,54 68.53,37.47 87,37.47 JP2.26
GPIO23
  Top 0.254: R4.1 45.95,40 87,40 JP2.24
N$1
  Top 0.254: R4.2 42.05,32.95 43,32 OP2.PIN1
N$2
  Top 0.254: OP2.PIN4 38,32 38.95,32.95 R3.2 38.95,40.05 37.91,41.09 Q2.PIN4
N$3
  Top 0.254: R2.2 42.05,53.95 44,52 OP1.PIN1
N$5
  Top 0.254: Q1.PIN4 37.91,61.09 39,60 39,58.05 | 39,58.05 R1.2 | OP1.PIN4 38,52 39,53 39,58.05

### Text on the board
tPlace: JLCJLCJLC | SAMAD ATTA | DEP
tNames: Q1 | OP1 | Q2 | OP2 | REV B